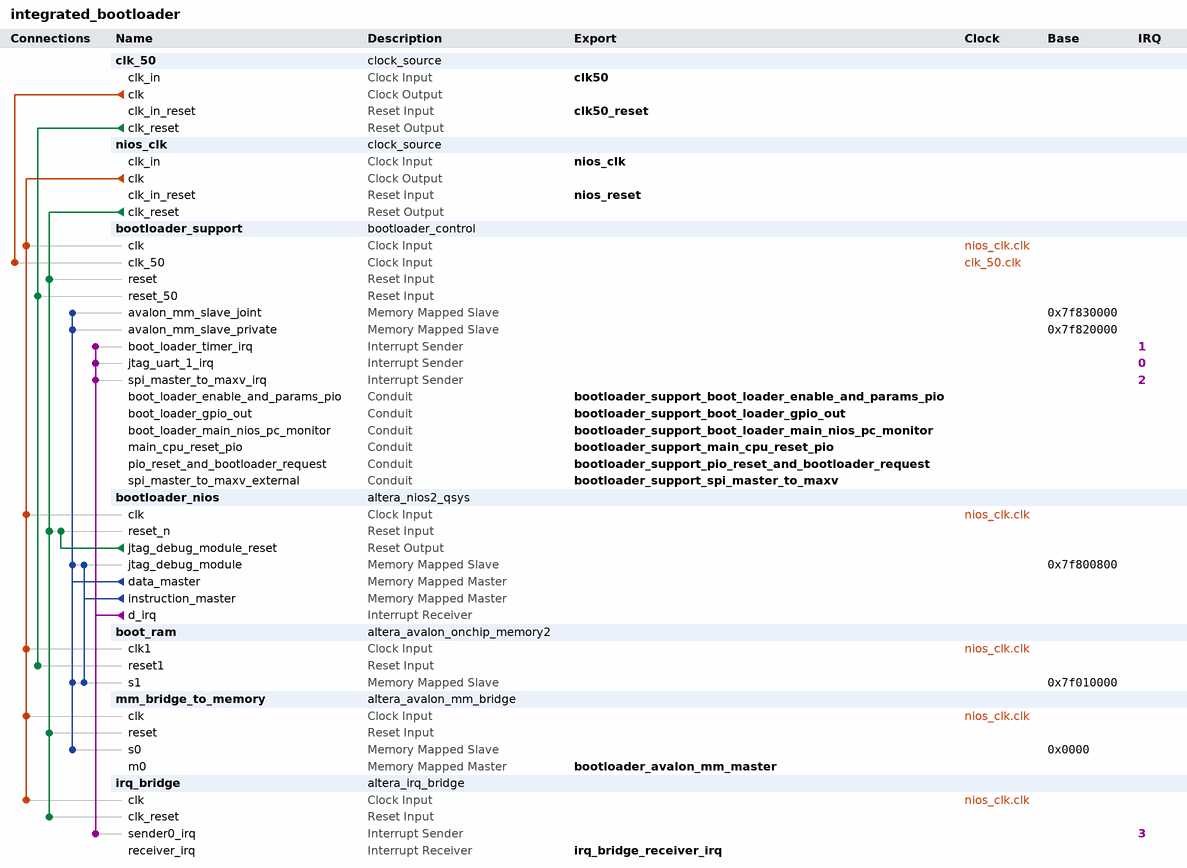
[diagram p0: system contents]
# Platform Designer (Qsys) system integrated_bootloader, Cyclone V 5CGTFD9E5F35C7
# Parameters at their usual value, and those the tool derives, are not listed.
package require -exact qsys 14.1
create_system integrated_bootloader
set_project_property DEVICE_FAMILY {Cyclone V}
set_project_property DEVICE 5CGTFD9E5F35C7

add_instance clk_50 clock_source 14.1
set_instance_parameter_value clk_50 clockFrequency 50000000
set_instance_parameter_value clk_50 resetSynchronousEdges BOTH

add_instance nios_clk clock_source 14.1
set_instance_parameter_value nios_clk clockFrequency 50000000
set_instance_parameter_value nios_clk resetSynchronousEdges BOTH

add_instance bootloader_support bootloader_control 1.0
set_instance_parameter_value bootloader_support LEGACY_ITEMS_SUSBSYTEM_ENABLED 0
set_instance_parameter_value bootloader_support VME_FIFO_SUBSYSTEM_ENABLED 0

add_instance bootloader_nios altera_nios2_qsys 14.1
set_instance_parameter_value bootloader_nios breakSlave bootloader_nios.jtag_debug_module
set_instance_parameter_value bootloader_nios cpuID -1341673465
set_instance_parameter_value bootloader_nios exceptionSlave boot_ram.s1
set_instance_parameter_value bootloader_nios icache_burstType Sequential
set_instance_parameter_value bootloader_nios icache_size 4096
set_instance_parameter_value bootloader_nios impl Small
set_instance_parameter_value bootloader_nios mmu_TLBMissExcSlave None
set_instance_parameter_value bootloader_nios muldiv_multiplierType LogicElementsFast
set_instance_parameter_value bootloader_nios resetSlave boot_ram.s1
set_instance_parameter_value bootloader_nios resetrequest_enabled true
set_instance_parameter_value bootloader_nios setting_illegalInstructionsTrap true
set_instance_parameter_value bootloader_nios setting_showInternalSettings true
set_instance_parameter_value bootloader_nios setting_showUnpublishedSettings true

add_instance boot_ram altera_avalon_onchip_memory2 14.1
set_instance_parameter_value boot_ram allowInSystemMemoryContentEditor true
set_instance_parameter_value boot_ram dataWidth 32
set_instance_parameter_value boot_ram dualPort false
set_instance_parameter_value boot_ram initMemContent true
set_instance_parameter_value boot_ram initializationFileName ../../../../../tsb/ip/exe/onchip_mem.hex
set_instance_parameter_value boot_ram instanceID b507
set_instance_parameter_value boot_ram memorySize 65536
set_instance_parameter_value boot_ram slave1Latency 2
set_instance_parameter_value boot_ram useNonDefaultInitFile true

add_instance mm_bridge_to_memory altera_avalon_mm_bridge 14.1
set_instance_parameter_value mm_bridge_to_memory ADDRESS_UNITS SYMBOLS
set_instance_parameter_value mm_bridge_to_memory ADDRESS_WIDTH 30
set_instance_parameter_value mm_bridge_to_memory DATA_WIDTH 32
set_instance_parameter_value mm_bridge_to_memory MAX_BURST_SIZE 4
set_instance_parameter_value mm_bridge_to_memory MAX_PENDING_RESPONSES 4
set_instance_parameter_value mm_bridge_to_memory USE_AUTO_ADDRESS_WIDTH 0

add_instance irq_bridge altera_irq_bridge 14.1
set_instance_parameter_value irq_bridge IRQ_WIDTH 1

# connections
add_connection clk_50.clk bootloader_support.clk_50 clock
add_connection nios_clk.clk boot_ram.clk1 clock
add_connection nios_clk.clk bootloader_nios.clk clock
add_connection nios_clk.clk bootloader_support.clk clock
add_connection nios_clk.clk irq_bridge.clk clock
add_connection nios_clk.clk mm_bridge_to_memory.clk clock
add_connection bootloader_nios.jtag_debug_module_reset bootloader_nios.reset_n reset
add_connection clk_50.clk_reset boot_ram.reset1 reset
add_connection clk_50.clk_reset bootloader_support.reset_50 reset
add_connection nios_clk.clk_reset bootloader_nios.reset_n reset
add_connection nios_clk.clk_reset bootloader_support.reset reset
add_connection nios_clk.clk_reset irq_bridge.clk_reset reset
add_connection nios_clk.clk_reset mm_bridge_to_memory.reset reset
add_connection bootloader_nios.data_master boot_ram.s1 avalon
set_connection_parameter_value bootloader_nios.data_master/boot_ram.s1 baseAddress 0x7f010000
add_connection bootloader_nios.data_master bootloader_nios.jtag_debug_module avalon
set_connection_parameter_value bootloader_nios.data_master/bootloader_nios.jtag_debug_module baseAddress 0x7f800800
add_connection bootloader_nios.data_master bootloader_support.avalon_mm_slave_joint avalon
set_connection_parameter_value bootloader_nios.data_master/bootloader_support.avalon_mm_slave_joint baseAddress 0x7f830000
add_connection bootloader_nios.data_master bootloader_support.avalon_mm_slave_private avalon
set_connection_parameter_value bootloader_nios.data_master/bootloader_support.avalon_mm_slave_private baseAddress 0x7f820000
add_connection bootloader_nios.data_master mm_bridge_to_memory.s0 avalon
set_connection_parameter_value bootloader_nios.data_master/mm_bridge_to_memory.s0 baseAddress 0x0000
add_connection bootloader_nios.instruction_master boot_ram.s1 avalon
set_connection_parameter_value bootloader_nios.instruction_master/boot_ram.s1 baseAddress 0x7f010000
add_connection bootloader_nios.instruction_master bootloader_nios.jtag_debug_module avalon
set_connection_parameter_value bootloader_nios.instruction_master/bootloader_nios.jtag_debug_module baseAddress 0x7f800800
add_connection bootloader_nios.d_irq bootloader_support.boot_loader_timer_irq interrupt
set_connection_parameter_value bootloader_nios.d_irq/bootloader_support.boot_loader_timer_irq irqNumber 1
add_connection bootloader_nios.d_irq bootloader_support.jtag_uart_1_irq interrupt
set_connection_parameter_value bootloader_nios.d_irq/bootloader_support.jtag_uart_1_irq irqNumber 0
add_connection bootloader_nios.d_irq bootloader_support.spi_master_to_maxv_irq interrupt
set_connection_parameter_value bootloader_nios.d_irq/bootloader_support.spi_master_to_maxv_irq irqNumber 2
add_connection bootloader_nios.d_irq irq_bridge.sender0_irq interrupt
set_connection_parameter_value bootloader_nios.d_irq/irq_bridge.sender0_irq irqNumber 3

# exported interfaces
add_interface bootloader_avalon_mm_master avalon master
set_interface_property bootloader_avalon_mm_master EXPORT_OF mm_bridge_to_memory.m0
add_interface bootloader_support_boot_loader_enable_and_params_pio conduit end
set_interface_property bootloader_support_boot_loader_enable_and_params_pio EXPORT_OF bootloader_support.boot_loader_enable_and_params_pio
add_interface bootloader_support_boot_loader_gpio_out conduit end
set_interface_property bootloader_support_boot_loader_gpio_out EXPORT_OF bootloader_support.boot_loader_gpio_out
add_interface bootloader_support_boot_loader_main_nios_pc_monitor conduit end
set_interface_property bootloader_support_boot_loader_main_nios_pc_monitor EXPORT_OF bootloader_support.boot_loader_main_nios_pc_monitor
add_interface bootloader_support_main_cpu_reset_pio conduit end
set_interface_property bootloader_support_main_cpu_reset_pio EXPORT_OF bootloader_support.main_cpu_reset_pio
add_interface bootloader_support_pio_reset_and_bootloader_request conduit end
set_interface_property bootloader_support_pio_reset_and_bootloader_request EXPORT_OF bootloader_support.pio_reset_and_bootloader_request
add_interface bootloader_support_spi_master_to_maxv conduit end
set_interface_property bootloader_support_spi_master_to_maxv EXPORT_OF bootloader_support.spi_master_to_maxv_external
add_interface clk50 clock sink
set_interface_property clk50 EXPORT_OF clk_50.clk_in
add_interface clk50_reset reset sink
set_interface_property clk50_reset EXPORT_OF clk_50.clk_in_reset
add_interface irq_bridge_receiver_irq interrupt receiver
set_interface_property irq_bridge_receiver_irq EXPORT_OF irq_bridge.receiver_irq
add_interface nios_clk clock sink
set_interface_property nios_clk EXPORT_OF nios_clk.clk_in
add_interface nios_reset reset sink
set_interface_property nios_reset EXPORT_OF nios_clk.clk_in_reset

set_interconnect_requirement {$system} qsys_mm.burstAdapterImplementation PER_BURST_TYPE_CONVERTER
set_interconnect_requirement {$system} qsys_mm.clockCrossingAdapter AUTO
set_interconnect_requirement {$system} qsys_mm.maxAdditionalLatency 4

save_system integrated_bootloader.qsys
